# EAGLE schematic comp-btm (EAGLE 9.6.2)
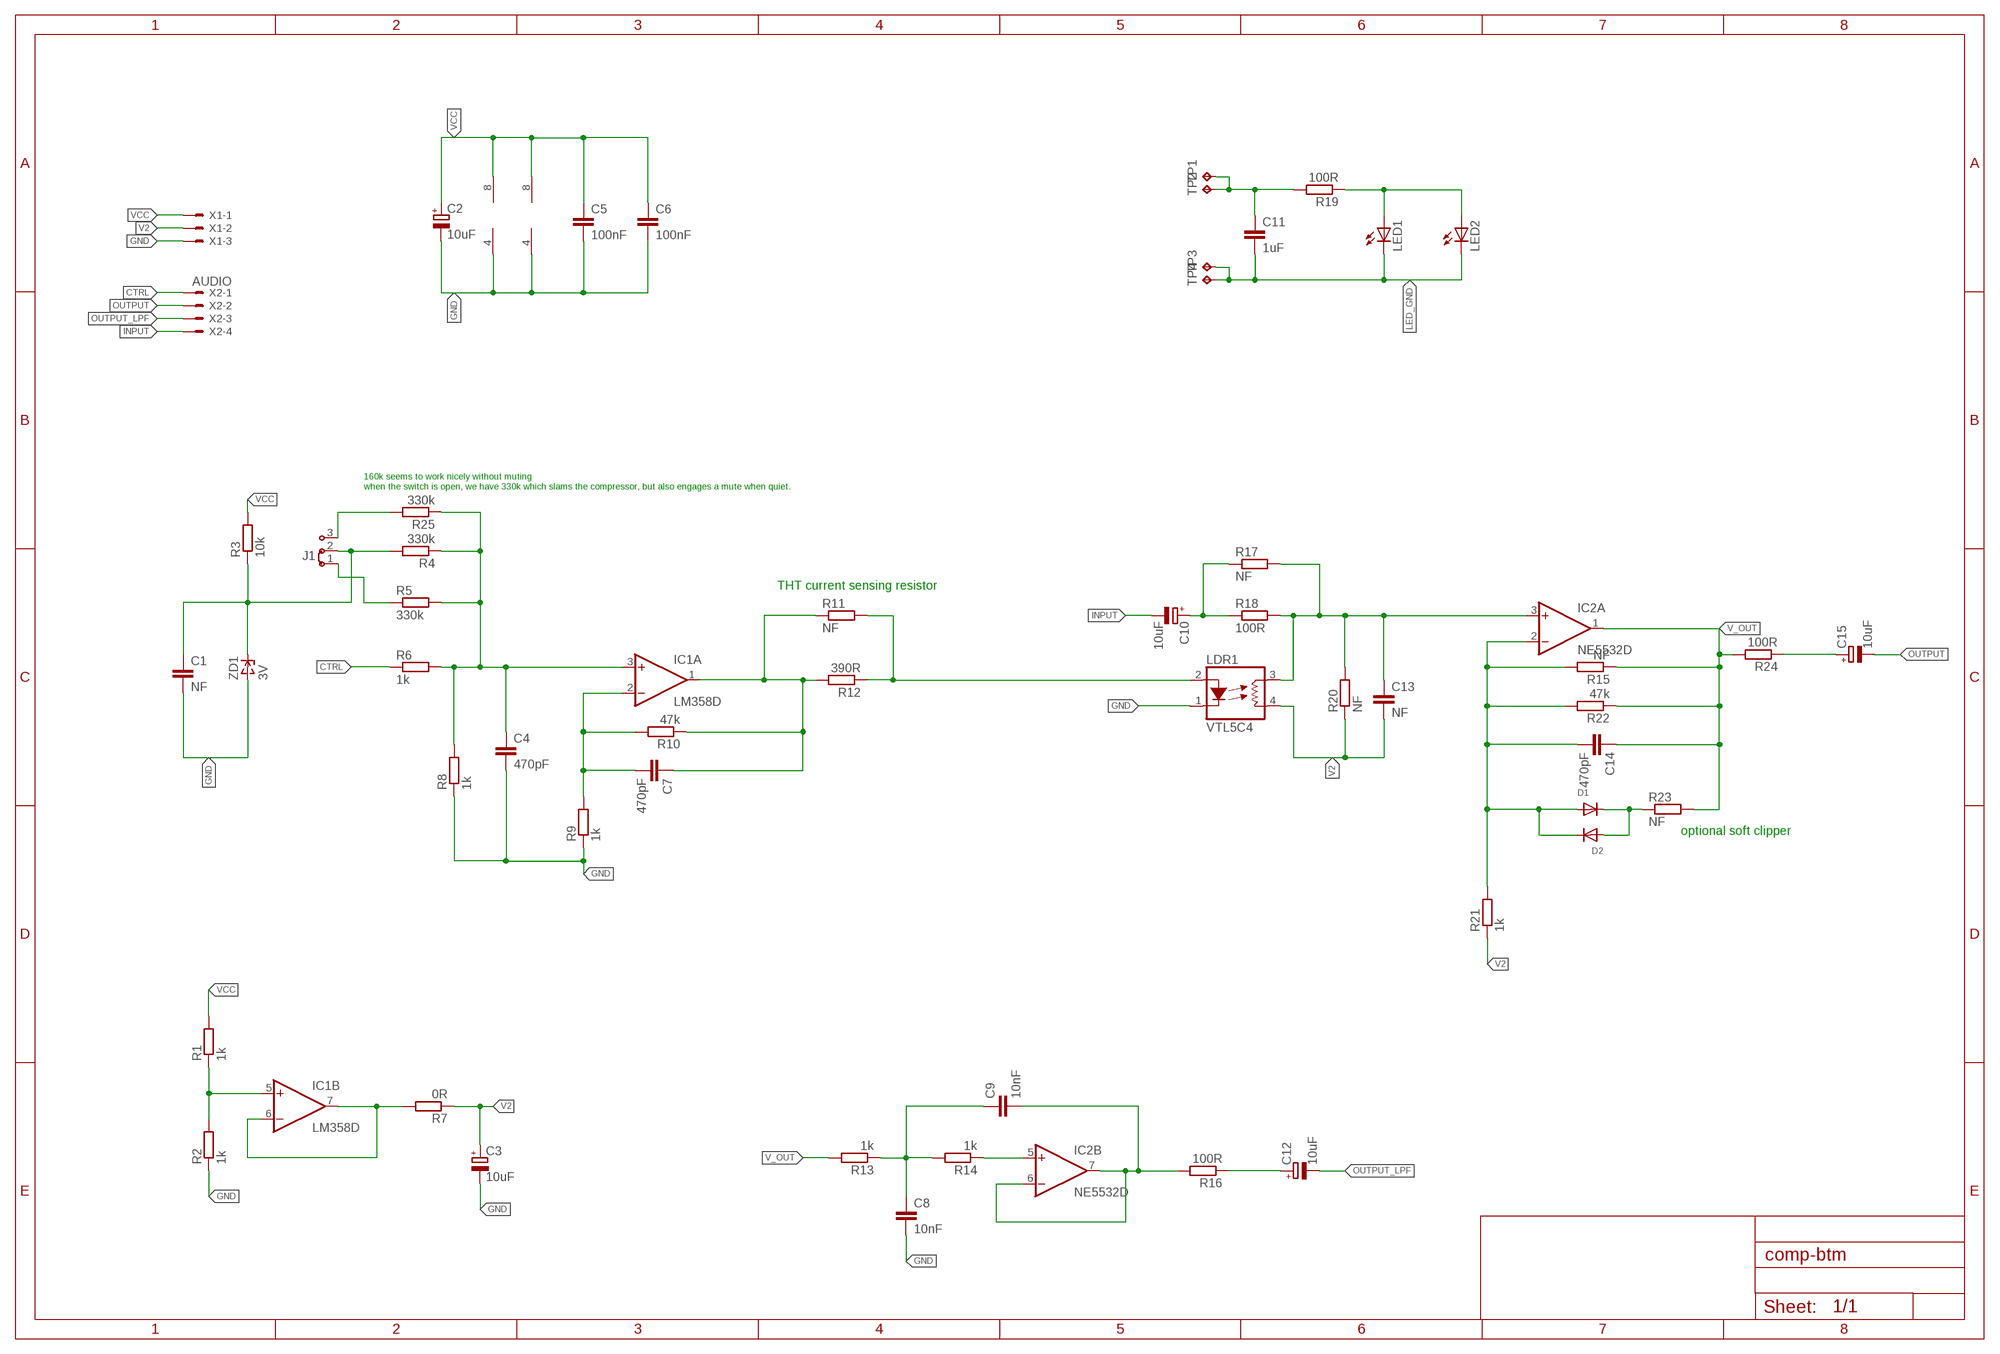
[diagram p0: schematic, sheet 1]

## Parts
C1  NF  C-EUC0805  [C0805]
C2  10uF  CPOL-EUE2,5-6E  [E2,5-6E]
C3  10uF  CPOL-EUE2,5-6E  [E2,5-6E]
C4  470pF  C-EUC0805  [C0805]
C5  100nF  C-EUC0805  [C0805]
C6  100nF  C-EUC0805  [C0805]
C7  470pF  C-EUC0805  [C0805]
C8  10nF  C-EUC0805  [C0805]
C9  10nF  C-EUC0805  [C0805]
C10  10uF  CPOL-EUE2,5-6E  [E2,5-6E]
C11  1uF  C-EUC0805  [C0805]
C12  10uF  CPOL-EUE2,5-6E  [E2,5-6E]
C13  NF  C-EUC0805  [C0805]
C14  470pF  C-EUC0805  [C0805]
C15  10uF  CPOL-EUE2,5-6E  [E2,5-6E]
D1  DIODEDO-1N4148  [DO-1N4148]
D2  DIODEDO-1N4148  [DO-1N4148]
IC1  LM358D  [SO08]
IC2  NE5532D  [SO08]
J1  J2X2MM  [04C]
LDR1  VTL5C4  VTL5C9  [VTL5C]
LED1  LEDCHIPLED_1206  [CHIPLED_1206]
LED2  LEDCHIPLED_1206  [CHIPLED_1206]
R1  1k  R-EU_R0805  [R0805]
R2  1k  R-EU_R0805  [R0805]
R3  10k  R-EU_R0805  [R0805]
R4  330k  R-EU_R0805  [R0805]
R5  330k  R-EU_R0805  [R0805]
R6  1k  R-EU_R0805  [R0805]
R7  0R  R-EU_R0805  [R0805]
R8  1k  R-EU_R0805  [R0805]
R9  1k  R-EU_R0805  [R0805]
R10  47k  R-EU_R0805  [R0805]
R11  NF  R-EU_0309/V  [0309V]
R12  390R  R-EU_R0805  [R0805]
R13  1k  R-EU_R0805  [R0805]
R14  1k  R-EU_R0805  [R0805]
R15  NF  R-EU_0309/V  [0309V]
R16  100R  R-EU_R0805  [R0805]
R17  NF  R-EU_0309/V  [0309V]
R18  100R  R-EU_R0805  [R0805]
R19  100R  R-EU_R0805  [R0805]
R20  NF  R-EU_R0805  [R0805]
R21  1k  R-EU_R0805  [R0805]
R22  47k  R-EU_R0805  [R0805]
R23  NF  R-EU_0309/V  [0309V]
R24  100R  R-EU_R0805  [R0805]
R25  330k  R-EU_R0805  [R0805]
TP1  +  TPTP20SQ  [TP20SQ]
TP2  TPTP20SQ  [TP20SQ]
TP3  TPTP20SQ  [TP20SQ]
TP4  TPTP20SQ  [TP20SQ]
X1  POWER  JST-XH-03-PIN-LONG-PAD  [JST-XH-03-PACKAGE-LONG-PAD]
X2  AUDIO  JST-XH-04-PIN-LONG-PAD  [JST-XH-04-PACKAGE-LONG-PAD]
ZD1  3V  ZENERSOD-123  [SOD-123]

## Nets
CTRL: R6.1 X2.1
GND: C1.2 C2.- C3.- C4.2 C5.2 C6.2 C8.2 IC1.4(P:V-) IC2.4(P:V-) LDR1.1(C) R2.1 R8.1 R9.1 X1.3 ZD1.A
INPUT: C10.- X2.4
LED_GND: C11.2 LED1.C LED2.C TP3.TP TP4.TP
N$1: IC1.5(B:+IN) R1.1 R2.2
N$2: C7.2 IC1.2(A:-IN) R9.2 R10.2
N$3: J1.1 R5.1
N$4: C14.2 D1.A D2.C IC2.2(A:-IN) R15.2 R21.2 R22.2
N$5: C12.+ R16.1
N$6: C7.1 IC1.1(A:OUT) R10.1 R11.1 R12.2
N$7: C13.1 IC2.3(A:+IN) LDR1.3(L1) R17.2 R18.2 R20.2
N$8: C10.+ R17.1 R18.1
N$9: C1.1 J1.2 R3.1 R4.2 ZD1.C
N$10: LDR1.2(A) R11.2 R12.1
N$11: C8.1 C9.1 R13.1 R14.2
N$12: C4.1 IC1.3(A:+IN) R4.1 R5.2 R6.2 R8.2 R25.1
N$13: C15.+ R24.1
N$14: IC1.6(B:-IN) IC1.7(B:OUT) R7.2
N$15: J1.3 R25.2
N$17: C9.2 IC2.6(B:-IN) IC2.7(B:OUT) R16.2
N$18: LED1.A LED2.A R19.1
N$19: D1.C D2.A R23.1
N$20: C11.1 R19.2 TP1.TP TP2.TP
N$21: IC2.5(B:+IN) R14.1
OUTPUT: C15.- X2.2
OUTPUT_LPF: C12.- X2.3
V2: C3.+ C13.2 LDR1.4(L2) R7.1 R20.1 R21.1 X1.2
V_OUT: C14.1 IC2.1(A:OUT) R13.2 R15.1 R22.1 R23.2 R24.2
VCC: C2.+ C5.1 C6.1 IC1.8(P:V+) IC2.8(P:V+) R1.2 R3.2 X1.1

## Notes on the sheet
- 160k seems to work nicely without muting
  when the switch is open, we have 330k which slams the compressor, but also engages a mute when quiet.
- THT current sensing resistor
- optional soft clipper

## Library data of the parts
C1 C4-C9 C11 C13 C14 = rcl:C-EU: CAPACITOR, European symbol; SPICEPREFIX: C
C2 C3 C10 C12 C15 = rcl:CPOL-EU: POLARIZED CAPACITOR, European symbol; SPICEPREFIX: C
D1 D2 = adafruit:DIODE: Diode SMADIODE - SMA Surface Mount Package 20V 1A Schottky Diode Digikey: 641-1014-6-ND DO-1N4148 - Through Hole Small Current Diode SOD-123 20V 1 A (.5mV Vf) Schottky Diode - Digikey: MBRX120TPMSCT-ND SOD-323 10V 570mA (.38mV Vf, 3ns) Schottky Diode - Digikey: ZLLS410CT-ND SOD-523 30V 30mA Schottky Diode (RB751S-40TE61) - Digikey: RB751S-40TE61CT-ND SOT23-R/W - SOT23 Package (R = Solder Paste/Reflow Ovens, W = Hand-Soldering) BAT54Film 40V 300mA - Digikey: 497-7162-1-ND
IC1 = linear:LM358: OP AMP also LM158; LM258; LM2904 Source: http://cache.national.com/ds/LM/LM158.pdf
IC2 = linear:NE5532: AUDIO AMPLIFIER
J1 = jumper:J2: Jumper switch 2 x 2.5 mm
LDR1 = optocoupler:VTL5C*: Low Cost Axial Vactrols Source: www.perkinelmer.com/opto ... vtl5c9_c10.pdf; MF: VACTEC PHOTO; MPN: VTL5C9; OC_FARNELL: 2067857; OC_NEWARK: 95F9033
LED1 LED2 = adafruit:LED: LED OSRAM: - CHIPLED LG R971, LG N971, LY N971, LG Q971, LY Q971, LO R971, LY R971 LH N974, LH R974 LS Q976, LO Q976, LY Q976 LO Q996 - Hyper CHIPLED LW Q18S LB Q993, LB Q99A, LB R99A - SideLED LS A670, LO A670, LY A670, LG A670, LP A670 LB A673, LV A673, LT A673, LW A673 LH A674 LY A675 LS A676, LA A676, LO A676, LY A676, LW A676 LS A679, LY A679, LG A679 - Hyper Micro SIDELED® LS Y876, LA Y876, LO Y876, LY Y876 LT Y87S - SmartLED LW L88C, LW L88S LB L89C, LB L89S, LG L890 LS L89K, LO L89K, LY L89K LS L896, LA L896, LO L896, LY L896 - TOPLED LS T670, LO T670, LY T670, LG T670, LP T670 LSG T670, LSP T670, LSY T670, LOP T670, LYG T670 LG T671, LOG T671, LSG T671 LB T673, LV T673, LT T673, LW T673 LH T674 LS T676, LA T676, LO T676, LY T676, LB T676, LH T676, LSB T676, LW T676 LB T67C, LV T67C, LT T67C, LS T67K, LO T67K, LY T67K, LW E67C LS E67B, LA E67B, LO E67B, LY E67B, LB E67C, LV E67C, LT E67C LW T67C LS T679, LY T679, LG T679 LS T770, LO T770, LY T770, LG T770, LP T770 LB T773, LV T773, LT T773, LW T773 LH T774 LS E675, LA E675, LY E675, LS T675 LS T776, LA T776, LO T776, LY T776, LB T776 LHGB T686 LT T68C, LB T68C - Hyper Mini TOPLED® LB M676 - Mini TOPLED Santana® LG M470 LS M47K, LO M47K, LY M47K Source: http://www.osram.convergy.de/
R1-R25 = rcl:R-EU_: RESISTOR, European symbol; SPICEPREFIX: R
TP1-TP4 = testpad:TP: Test pad
X1 = JST XH Connectors v1-0 2:JST-XH-03-PIN: JST XH Connector 2 Pin Wire to board connector. Pitch: 2,54 mm, (0.100") Number of pins: 3 Created by Rembrandt Electronics www.rembrandtelectronics.com
X2 = JST XH Connectors v1-0 2:JST-XH-04-PIN: JST XH Connector 2 Pin Wire to board connector. Pitch: 2,54 mm, (0.100") Number of pins: 4 Created by Rembrandt Electronics www.rembrandtelectronics.com
ZD1 = dp_devices:ZENER: Zener Diode SOD-323